# EAGLE design AT86RF233+RPI_2 (EAGLE 7.5.0)
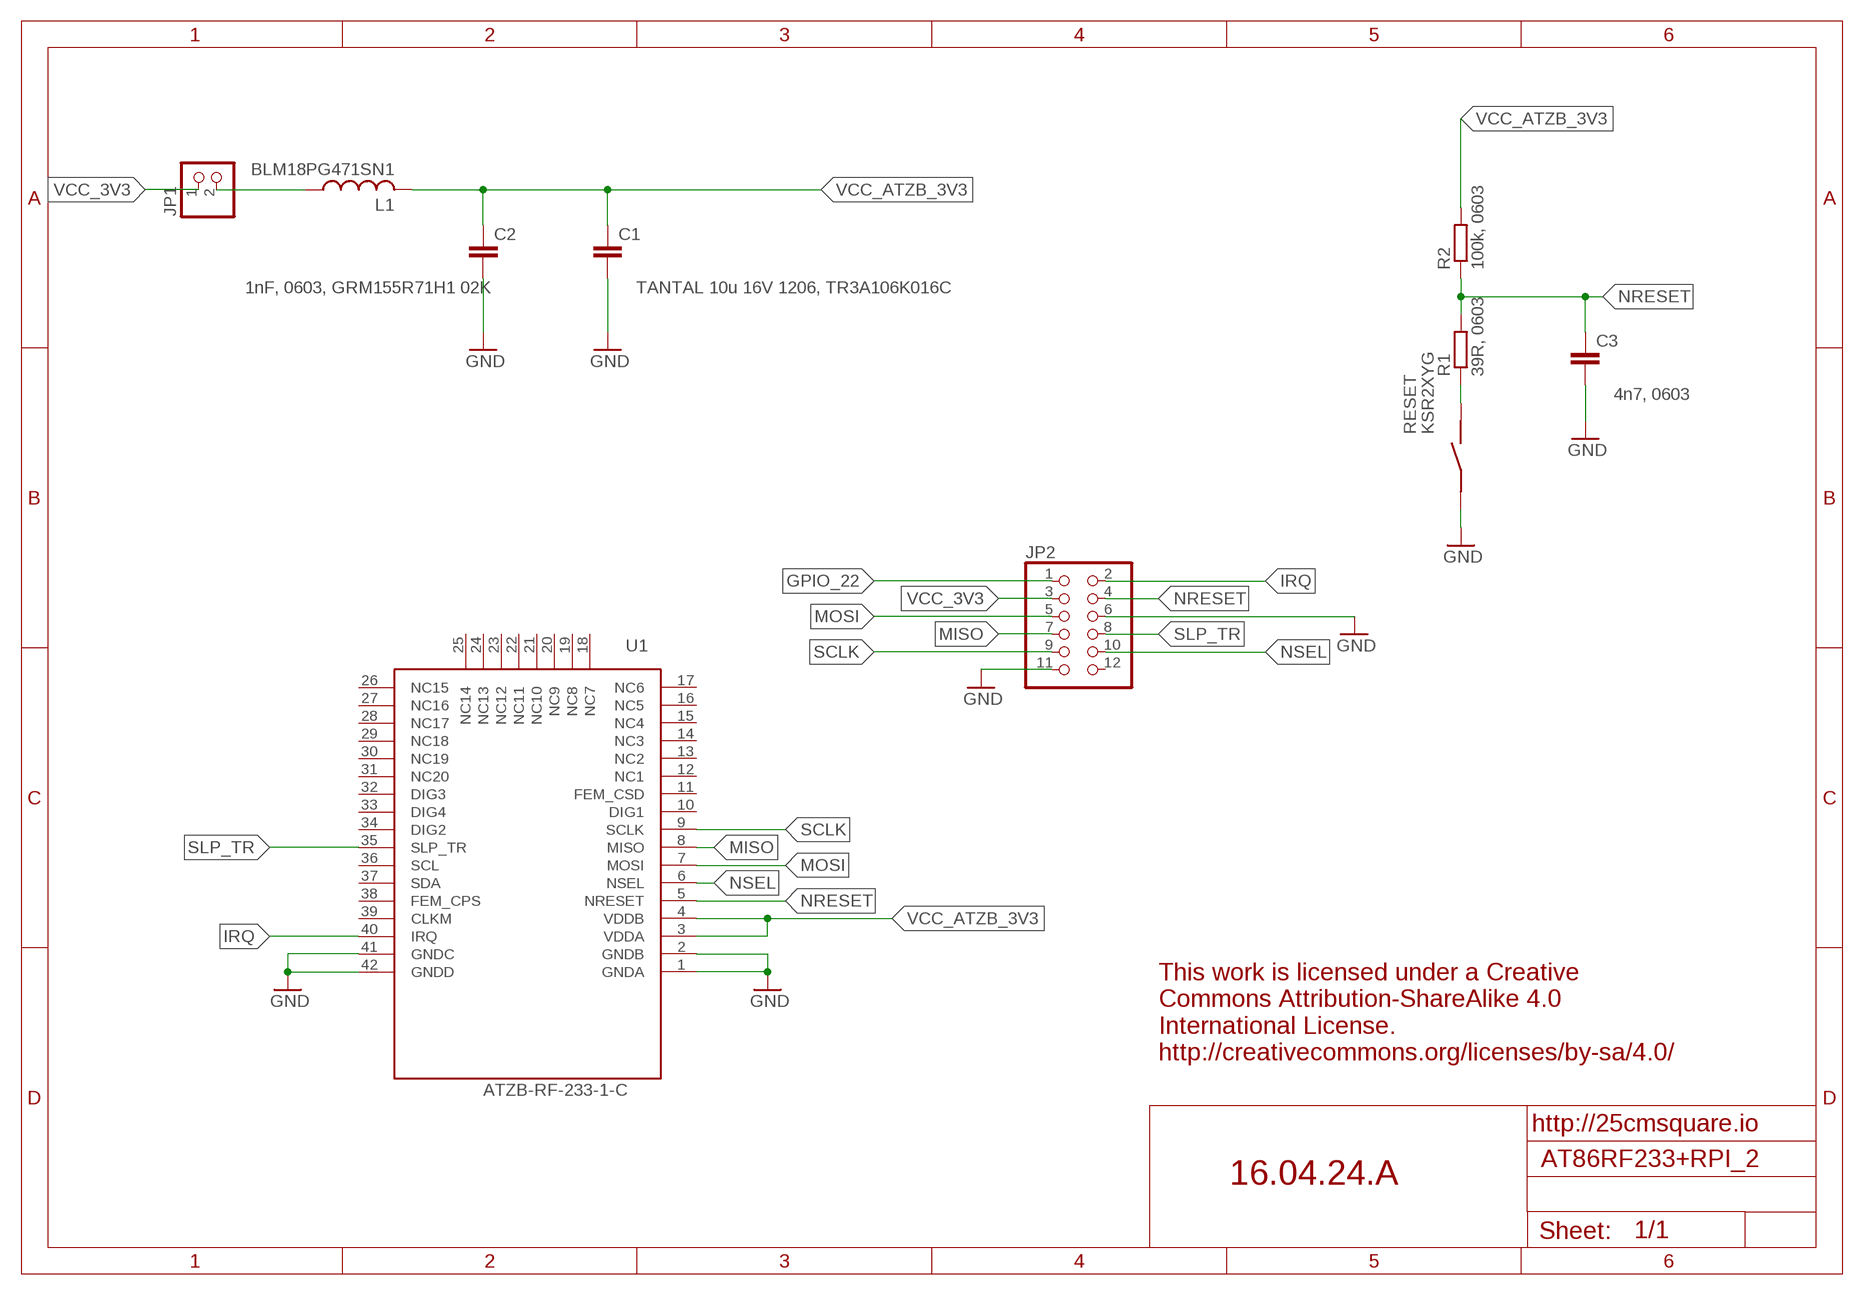
[diagram p0: schematic, sheet 1]

## Parts
C1  TANTAL 10u 16V 1206, TR3A106K016C  C-EUC1206K  [C1206K]
C2  1nF, 0603, GRM155R71H1 02K  C-EUC0603K  [C0603K]
C3  4n7, 0603  C-EUC0603K  [C0603K]
JP1  PINHD-1X2  [1X02]
JP2  PINHD-2X6  [2X06]
L1  BLM18PG471SN1  L0603(1608)  [L0603]
R1  39R, 0603  R-EU_R0603  [R0603]
R2  100k, 0603  R-EU_R0603  [R0603]
RESET  KSR2XYG  [KSR2XYG]
U1  ATZB-RF-233-1-C  [ATZB-RF-233-1-C]

## Nets
GND: C1.2 C2.2 C3.2 JP2.6 JP2.11 RESET.P$2 U1.1(GNDA) U1.2(GNDB) U1.41(GNDC) U1.42(GNDD)
GPIO_22: JP2.1
IRQ: JP2.2 U1.40(IRQ)
MISO: JP2.7 U1.8(MISO)
MOSI: JP2.5 U1.7(MOSI)
N$1: R1.1 RESET.P$1
N$3: JP1.2 L1.1
NRESET: C3.1 JP2.4 R1.2 R2.1 U1.5(NRESET)
NSEL: JP2.10 U1.6(NSEL)
SCLK: JP2.9 U1.9(SCLK)
SLP_TR: JP2.8 U1.35(SLP_TR)
VCC_3V3: JP1.1 JP2.3
VCC_ATZB_3V3: C1.1 C2.1 L1.2 R2.2 U1.3(VDDA) U1.4(VDDB)
Unconnected: JP2.12 U1.10(DIG1) U1.11(FEM_CSD) U1.12(NC1) U1.13(NC2) U1.14(NC3) U1.15(NC4) U1.16(NC5) U1.17(NC6) U1.18(NC7) U1.19(NC8) U1.20(NC9) U1.21(NC10) U1.22(NC11) U1.23(NC12) U1.24(NC13) U1.25(NC14) U1.26(NC15) U1.27(NC16) U1.28(NC17) U1.29(NC18) U1.30(NC19) U1.31(NC20) U1.32(DIG3) U1.33(DIG4) U1.34(DIG2) U1.36(SCL) U1.37(SDA) U1.38(FEM_CPS) U1.39(CLKM)

## Notes on the sheet
- This work is licensed under a Creative
  Commons Attribution-ShareAlike 4.0
  International License.
  http://creativecommons.org/licenses/by-sa/4.0/
- http://25cmsquare.io
- 16.04.24.A

## Library data of the parts
C1 = resistor:C-EU: CAPACITOR, European symbol; SPICEPREFIX: C
C2 C3 = rcl:C-EU: CAPACITOR, European symbol
JP1 = pinhead:PINHD-1X2: PIN HEADER
JP2 = pinhead:PINHD-2X6: PIN HEADER
L1 = 25cmsquare:L
R1 R2 = resistor:R-EU_: RESISTOR, European symbol; SPICEPREFIX: R
RESET = 25cmsquare:KSR2XYG: KSR Series Subminiature Tact Switch for SMT
U1 = 25cmsquare:ATZB-RF-233-1-C

## Board
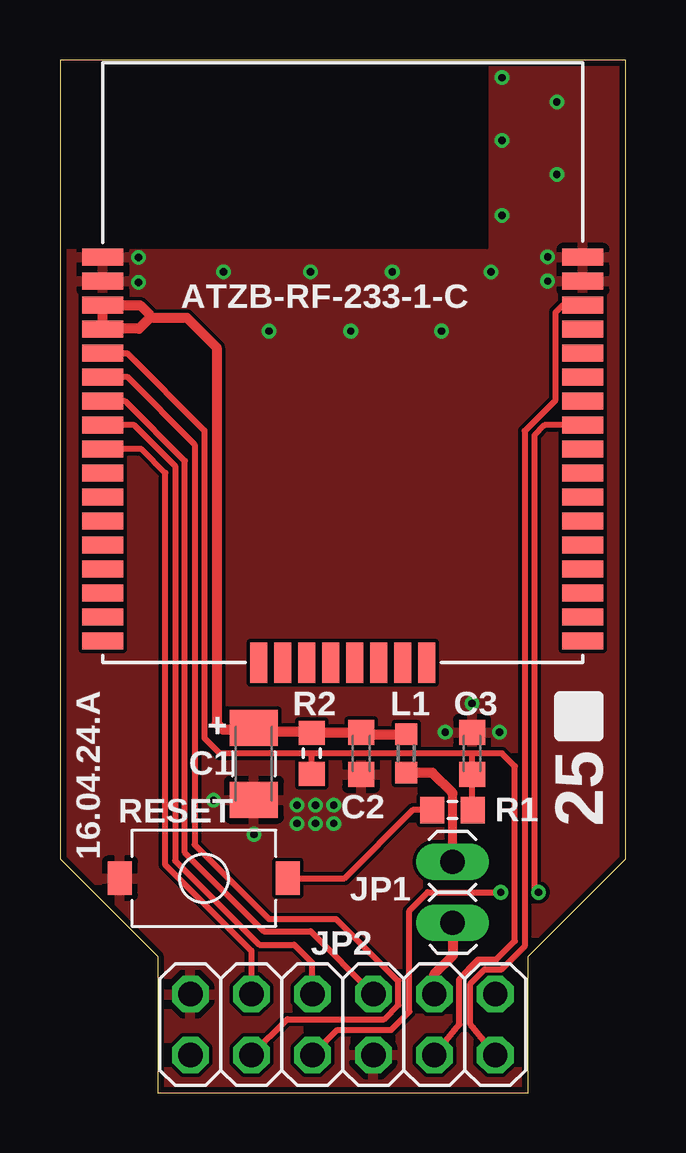
[diagram p1: board, top side]
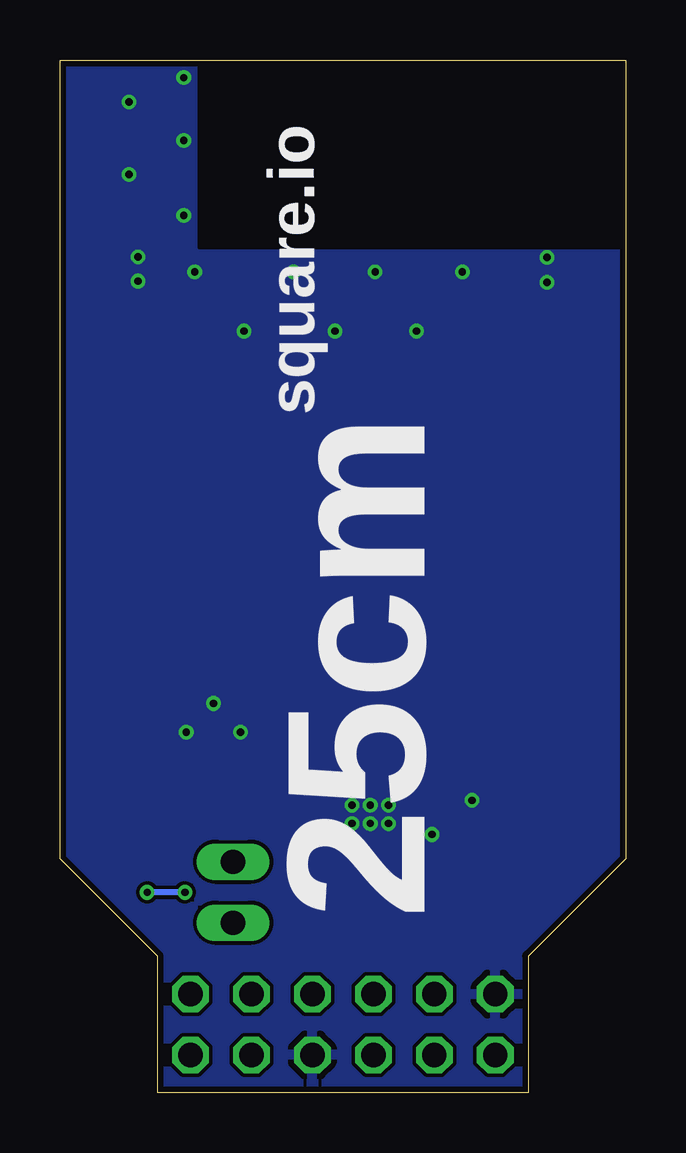
[diagram p2: board, bottom side, seen from below]

Size 23.57 x 43.05 mm. Coordinates in mm from the lower left corner, seen from the top.
Outline: 4.06,0 19.51,0 19.51,5.69 23.57,9.75 23.57,43.05 0,43.05 0,9.75 4.06,5.69 4.06,0
Copper layers (1*16): Top 0.035mm / dielectric 1.5mm / Bottom 0.035mm
Design rules "SeeedStudio_2layer_DRU_no_angle_20140221": minimum track width 6mil, minimum drill 12mil, track to track 6mil, track to pad 6mil, pad to pad 6mil, via to via 6mil, smd to smd 0mil, copper to edge 10mil, drill to drill 10mil, minimum pad ring 10mil, minimum via ring 6mil, stop-mask expansion 2mil, vias tented up to drill 100mil, thermal gap 10mil

### Footprints (pad centres in the part's own frame; a part is rotated, then mirrored left to right if it is on the bottom)
C1206K = smd 1.5 x 2: 1 -1.5,0; 2 1.5,0
C0603K = smd 1.05 x 1.08: 1 -0.875,0; 2 0.875,0
1X02 = drill 1.016 long: 1 -1.27,0; 2 1.27,0
2X06 = drill 1.016 octagon: 1 -6.35,-1.27; 2 -6.35,1.27; 3 -3.81,-1.27; 4 -3.81,1.27; 5 -1.27,-1.27; 6 -1.27,1.27; 7 1.27,-1.27; 8 1.27,1.27; 9 3.81,-1.27; 10 3.81,1.27; 11 6.35,-1.27; 12 6.35,1.27
L0603 = smd 0.9 x 0.9: 1 -0.8,0; 2 0.8,0
R0603 = smd 1 x 1.1: 1 -0.85,0; 2 0.85,0
KSR2XYG = smd 1.4 x 1: P$1 0,0; P$2 0,7
ATZB-RF-233-1-C = smd 1.7 x 0.7: 1 10,-4.4; 2 10,-3.4; 3 10,-2.4; 4 10,-1.4; 5 10,-0.4; 6 10,0.6; 7 10,1.6; 8 10,2.6; 9 10,3.6; 10 10,4.6; 11 10,5.6; 12 10,6.6; 13 10,7.6; 14 10,8.6; 15 10,9.6; 16 10,10.6; 17 10,11.6; 26 -10,11.6; 27 -10,10.6; 28 -10,9.6; 29 -10,8.6; 30 -10,7.6; 31 -10,6.6; 32 -10,5.6; 33 -10,4.6; 34 -10,3.6; 35 -10,2.6; 36 -10,1.6; 37 -10,0.6; 38 -10,-0.4; 39 -10,-1.4; 40 -10,-2.4; 41 -10,-3.4; 42 -10,-4.4 | smd 0.7 x 1.7: 18 3.5,12.5; 19 2.5,12.5; 20 1.5,12.5; 21 0.5,12.5; 22 -0.5,12.5; 23 -1.5,12.5; 24 -2.5,12.5; 25 -3.5,12.5

### Placement (x,y rotation side)
C1  8.08,13.72 270 top
C2  12.55,14.15 270 top
C3  17.17,14.15 90 top
JP1  16.36,8.36 90 top
JP2  11.79,2.84 180 top
L1  14.43,14.15 90 top
R1  16.36,11.79 0 top
R2  10.49,14.15 90 top
RESET  9.5,8.94 90 top
U1  11.79,30.43 180 top

### Tracks (layer width: path | path; a pad name or v marks a point on that pad's centre or on a via)
GND  (via drill 0.3)
  other vias: 10.64,11.23 11.4,11.23 10.64,11.99 11.4,11.99 16.05,15.04 18.31,15.04 17.17,16.23 9.88,11.23 9.88,11.99 3.28,34.82 3.28,33.78 20.32,34.85 20.32,33.83 8.08,10.77 6.81,34.21 10.44,34.21 13.84,34.21 17.96,34.21 18.41,39.7 18.41,42.32 18.41,36.58 8.71,31.75 12.12,31.75 15.9,31.75 20.7,38.28 20.7,41.3 6.4,12.19
  pour Bottom: -2.54,44.7 27.56,44.75 27.56,-2.06 -2.54,-2.11
  pour Top: -12.01,48.18 39.14,48.18 39.14,-10.11 -12.01,-10.11
IRQ
  Top 0.254: U1.40 20.94,32.83 20.65,32.54 20.65,28.88 19.36,27.58 19.36,6.1 18.41,5.16 17.7,5.16 17.09,4.55 17.09,2.85 JP2.2
MISO
  Top 0.254: U1.8 3.1,27.83 4.8,26.13 4.8,9.68 8.31,6.17 9.75,6.17 10.52,5.41 JP2.7
MOSI
  Top 0.254: U1.7 2.72,28.83 5.21,26.34 5.21,10.01 8.48,6.73 10.44,6.73 JP2.5
N$1
  Top 0.254: RESET.P$1 11.86,8.94 14.71,11.79 R1.1
N$3
  Top 0.381: JP1.2 16.36,12.47
  Top 0.406: L1.1 14.44,13.34 15.52,13.34 16.36,12.5 16.36,12.47
NRESET
  Top 0.254: U1.5 2.8,30.83 6.02,27.61 6.02,14.78 6.66,14.15 10.49,14.15 | JP2.4 16.64,2.85 16.64,4.75 17.02,5.16 17.42,5.56 18.19,5.56 18.95,6.33 18.95,13.61 18.41,14.15 17.17,14.15 | R2.1 10.54,13.15 | 17.17,14.15 10.49,14.15 | 10.74,13.11 10.5,13.16 R2.1 | 17.17,14.15 C3.1 17.17,11.79 R1.2 | R2.1 10.49,14.15
NSEL
  Top 0.254: U1.6 1.8,29.84 2.79,29.84 5.61,27.03 5.61,10.34 8.71,7.24 11.51,7.24 14.07,4.67 14.1,4.67 14.1,3.66 13.51,3.07 9.47,3.07 JP2.10
SCLK
  Top 0.254: U1.9 3.4,26.83 4.39,25.84 4.39,9.5 7.98,5.92 JP2.9 8.1,4.12
SLP_TR  (via drill 0.3)
  Top 0.254: U1.35 20.18,27.83 19.76,27.41 19.76,8.53 v19.94,8.36 | JP2.8 11.56,2.62 13.79,2.62 14.55,3.38 14.55,7.59 15.32,8.36 v18.36,8.36
  Bottom 0.254: v18.36,8.36 v19.94,8.36
VCC_3V3
  Top 0.406: JP2.3 15.6,4.95 16.38,5.74 16.38,7.06 JP1.1
VCC_ATZB_3V3
  Top 0.406: U1.4 U1.3 3.34,32.83 3.73,32.44 3.73,32.31 | R2.2 10.49,14.92 | 3.73,32.31 3.73,32.28 3.3,31.85 | 3.3,31.85 1.88,31.85 1.85,31.88 | 3.3,31.85 3.3,31.88 3.73,32.31 | 3.73,32.31 5.28,32.31 6.53,31.06 6.53,15.39 6.78,15.14 8.1,15.14 C1.1 8.71,15.22 8.89,15.04 10.3,15.04 10.37,15.11 R2.2 | R2.2 10.52,15.02 C2.1 12.62,14.95 L1.2

### Text on the board
tNames: + | 25 | 16.04.24.A
bNames: square.io | 25cm